# EAGLE design Arduino-Rework Station (EAGLE 8.2.2)

## Sheet 1 of 2
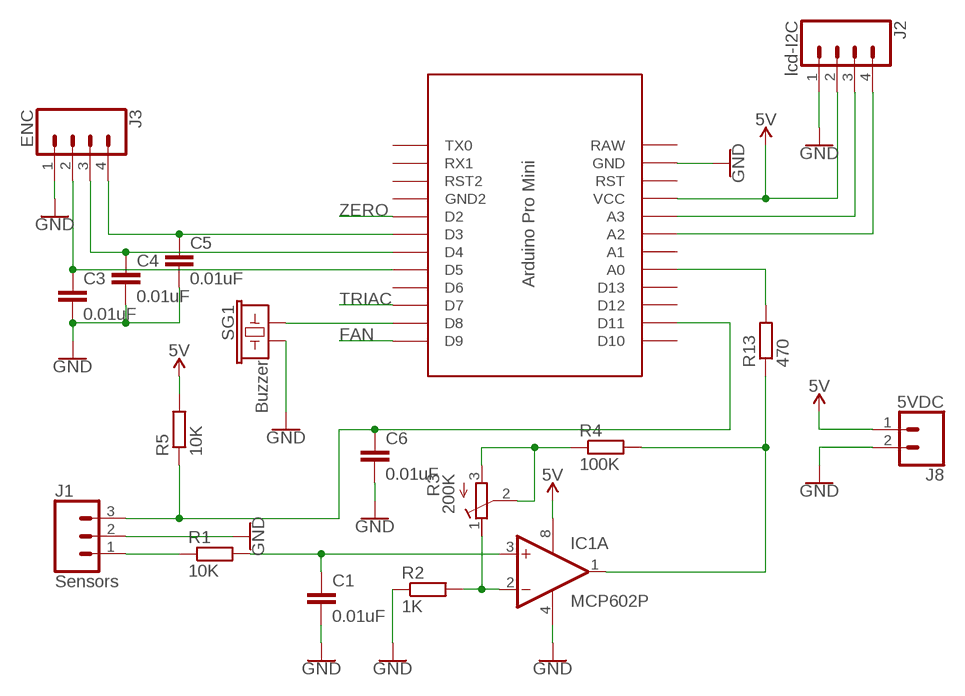
[diagram p0: schematic, sheet 1]

### Parts
C1  0.01uF  C-EU025-024X044  [C025-024X044]
C3  0.01uF  C-EU025-024X044  [C025-024X044]
C4  0.01uF  C-EU025-024X044  [C025-024X044]
C5  0.01uF  C-EU025-024X044  [C025-024X044]
C6  0.01uF  C-EU025-024X044  [C025-024X044]
IC1  MCP602P  [DIL08]
J1  Sensors  CONN_03POLAR  [MOLEX-1X3]
J2  lcd-I2C  CONN_04POLAR  [MOLEX-1X4]
J3  ENC  CONN_04POLAR  [MOLEX-1X4]
J8  5VDC  CONN_02POLAR  [MOLEX-1X2]
R1  10K  R-EU_0207/10  [0207/10]
R2  1K  R-EU_0207/10  [0207/10]
R3  200K  R-TRIMM3006P  [RTRIM3006P]
R4  100K  R-EU_0207/10  [0207/10]
R5  10K  R-EU_0207/10  [0207/10]
R13  470  R-EU_0207/10  [0207/10]
SG1  Buzzer  BUZZER-PTH  [BUZZER-12MM]
U$1  PRO-MINI  [PRO-MINI]

### Nets
5V: IC1.8(P:V+) J2.2 J8.1 R5.2 U$1.VCC ; also sheet 2
FAN: U$1.D9 ; also sheet 2
GND: C1.2 C3.2 C4.2 C5.2 C6.2 IC1.4(P:V-) J1.2 J2.1 J3.1 J8.2 R2.1 SG1.- U$1.GND ; also sheet 2
N$1: C5.1 J3.4 U$1.D3
N$2: C4.1 J3.3 U$1.D4
N$3: C3.1 J3.2 U$1.D5
N$4: J2.3 U$1.A3
N$5: J2.4 U$1.A2
N$6: J1.1 R1.1
N$7: C1.1 IC1.3(A:+IN) R1.2
N$8: IC1.2(A:-IN) R2.2 R3.1(E)
N$9: R3.2(S) R3.3(A) R4.1
N$10: IC1.1(A:OUT) R4.2 R13.1
N$11: C6.1 J1.3 R5.1 U$1.D11
N$12: SG1.+ U$1.D8
N$27: R13.2 U$1.A0
TRIAC: U$1.D7 ; also sheet 2
ZERO: U$1.D2 ; also sheet 2
Unconnected: IC1.5(B:+IN) IC1.6(B:-IN) IC1.7(B:OUT) U$1.A1 U$1.D6 U$1.D10 U$1.D12 U$1.D13 U$1.GND1(GND2) U$1.RST U$1.RST1(RST2) U$1.RX1 U$1.TX0

## Sheet 2 of 2
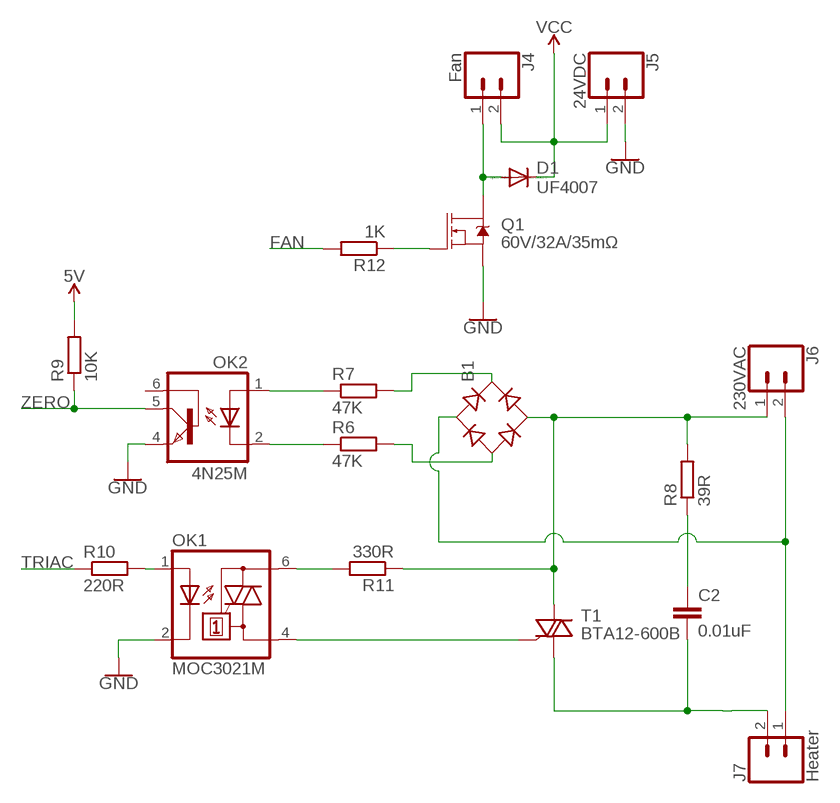
[diagram p1: schematic, sheet 2]

### Parts
B1  RB1A  [RB1A]
C2  0.01uF  C-EU050-045X075  [C050-045X075]
D1  UF4007  1N4004  [DO41-10]
J4  Fan  CONN_02POLAR  [MOLEX-1X2]
J5  24VDC  CONN_025MM  [SCREWTERMINAL-5MM-2]
J6  230VAC  CONN_02PTH4  [1X02_XTRA_BIG]
J7  Heater  CONN_02PTH4  [1X02_XTRA_BIG]
OK1  MOC3021M  [DIL06]
OK2  4N25M  [DIL06]
Q1  60V/32A/35mΩ  MOSFET-NCH-FQP30N06L  [TO220V]
R6  47K  R-EU_0204/7  [0204/7]
R7  47K  R-EU_0204/7  [0204/7]
R8  39R  R-EU_0617/22  [0617/22]
R9  10K  R-EU_0204/7  [0204/7]
R10  220R  R-EU_0204/7  [0204/7]
R11  330R  R-EU_0204/7  [0204/7]
R12  1K  R-EU_0204/7  [0204/7]
T1  BTA12-600B  BT138-V  [TO220BV]

### Nets
5V: R9.2 ; also sheet 1
FAN: R12.2 ; also sheet 1
GND: J5.2 OK1.2(C) OK2.4(EMI) Q1.3(S) ; also sheet 1
N$14: OK1.1(A) R10.2
N$15: OK2.1(A) R7.1
N$16: OK2.2(C) R6.1
N$17: B1.+ R7.2
N$18: B1.- R6.2
N$19: B1.AC2 J6.1 R8.2 R11.1 T1.T2(A2)
N$20: C2.1 R8.1
N$21: B1.AC1 J6.2 J7.1
N$22: OK1.6(A2) R11.2
N$23: OK1.4(A1) T1.G
N$24: D1.A J4.1 Q1.2(D)
N$25: C2.2 J7.2 T1.T1(A1)
N$26: Q1.1(G) R12.1
TRIAC: R10.1 ; also sheet 1
VCC: D1.C J4.2 J5.1
ZERO: OK2.5(COL) R9.1 ; also sheet 1
Unconnected: OK2.6(BAS)

## Power pins joined to a net without a drawn wire
RAW: U$1.RAW

## Library data of the parts
B1 = rectifier:RB1A: RECTIFIER 1 A
C1-C6 = resistor:C-EU: CAPACITOR, European symbol
D1 = diode:1N4004: DIODE general purpose rectifier, 1 A
IC1 = linear:MCP602: Single Op Amp 2.7V to 6.0V Single Supply CMOS Source: http://ww1.microchip.com/downloads/en/DeviceDoc/21314g.pdf
J1 = SparkFun-Connectors:CONN_03: Multi connection point. Often used as Generic Header-pin footprint for 0.1 inch spaced/style header connections On any of the 0.1 inch spaced packages, you can populate with these: Break Away Headers - Straight <https://www.sparkfun.com/products/116> (PRT-00116) Break Away Male Headers - Right Angle <https://www.sparkfun.com/products/553> (PRT-00553) Female Headers <https://www.sparkfun.com/products/115> (PRT-00115) Break Away Headers - Machine Pin <https://www.sparkfun.com/products/117> (PRT-00117) Break Away Female Headers - Swiss Machine Pin <https://www.sparkfun.com/products/743> (PRT-00743) Stackable Header - 3 Pin (Female, 0.1") <https://www.sparkfun.com/products/13875> (PRT-13875) For SCREWTERMINALS and SPRING TERMINALS visit here: Screw Terimnals on SparkFun.com <https://www.sparkfun.com/search/results?term=Screw+Terminals> (5mm/3.5mm/2.54mm spacing) This device is also useful as a general connection point to wire up your design to another part of your project. Our various solder wires solder well into these plated through hole pads. Hook-Up Wire - Assortment (Stranded, 22 AWG) <https://www.sparkfun.com/products/11375> (PRT-11375) Hook-Up Wire - Assortment (Solid Core, 22 AWG) <https://www.sparkfun.com/products/11367> (PRT-11367) View the entire wire category on our website here <https://www.sparkfun.com/categories/141> Special notes: Molex polarized connector foot print use with SKU : PRT-08232 with associated crimp pins and housings.; PROD_ID: CONN-08625; SF_ID: PRT-08096
J2 J3 = SparkFun-Connectors:CONN_04: Multi connection point. Often used as Generic Header-pin footprint for 0.1 inch spaced/style header connections On any of the 0.1 inch spaced packages, you can populate with these: Break Away Headers - Straight <https://www.sparkfun.com/products/116> (PRT-00116) Break Away Male Headers - Right Angle <https://www.sparkfun.com/products/553> (PRT-00553) Female Headers <https://www.sparkfun.com/products/115> (PRT-00115) Break Away Headers - Machine Pin <https://www.sparkfun.com/products/117> (PRT-00117) Break Away Female Headers - Swiss Machine Pin <https://www.sparkfun.com/products/743> (PRT-00743) For SCREWTERMINALS and SPRING TERMINALS visit here: Screw Terimnals on SparkFun.com <https://www.sparkfun.com/search/results?term=Screw+Terminals> (5mm/3.5mm/2.54mm spacing) This device is also useful as a general connection point to wire up your design to another part of your project. Our various solder wires solder well into these plated through hole pads. Hook-Up Wire - Assortment (Stranded, 22 AWG) <https://www.sparkfun.com/products/11375> (PRT-11375) Hook-Up Wire - Assortment (Solid Core, 22 AWG) <https://www.sparkfun.com/products/11367> (PRT-11367) View the entire wire category on our website here <https://www.sparkfun.com/categories/141> Special notes: Molex polarized connector foot print use with SKU : PRT-08231 with associated crimp pins and housings. 1MM SMD Version SKU: PRT-10208; PROD_ID: CONN-08186; SF_ID: PRT-08231
J4 J8 = SparkFun-Connectors:CONN_02: Multi connection point. Often used as Generic Header-pin footprint for 0.1 inch spaced/style header connections On any of the 0.1 inch spaced packages, you can populate with these: Break Away Headers - Straight <https://www.sparkfun.com/products/116> (PRT-00116) Break Away Male Headers - Right Angle <https://www.sparkfun.com/products/553> (PRT-00553) Female Headers <https://www.sparkfun.com/products/115> (PRT-00115) Break Away Headers - Machine Pin <https://www.sparkfun.com/products/117> (PRT-00117) Break Away Female Headers - Swiss Machine Pin <https://www.sparkfun.com/products/743> (PRT-00743) For SCREWTERMINALS and SPRING TERMINALS visit here: Screw Terimnals on SparkFun.com <https://www.sparkfun.com/search/results?term=Screw+Terminals> (5mm/3.5mm/2.54mm spacing) This device is also useful as a general connection point to wire up your design to another part of your project. Our various solder wires solder well into these plated through hole pads. Hook-Up Wire - Assortment (Stranded, 22 AWG) <https://www.sparkfun.com/products/11375> (PRT-11375) Hook-Up Wire - Assortment (Solid Core, 22 AWG) <https://www.sparkfun.com/products/11367> (PRT-11367) View the entire wire category on our website here <https://www.sparkfun.com/categories/141> Special notes: Molex polarized connector foot print use with: PRT-08233 with associated crimp pins and housings. 2.54_SCREWTERM for use with PRT-10571. 3.5mm Screw Terminal footprints for PRT-08084 5mm Screw Terminal footprints for use with PRT-08432; SF_ID: PRT-09918
J5 = SparkFun-Connectors:CONN_02: Multi connection point. Often used as Generic Header-pin footprint for 0.1 inch spaced/style header connections On any of the 0.1 inch spaced packages, you can populate with these: Break Away Headers - Straight <https://www.sparkfun.com/products/116> (PRT-00116) Break Away Male Headers - Right Angle <https://www.sparkfun.com/products/553> (PRT-00553) Female Headers <https://www.sparkfun.com/products/115> (PRT-00115) Break Away Headers - Machine Pin <https://www.sparkfun.com/products/117> (PRT-00117) Break Away Female Headers - Swiss Machine Pin <https://www.sparkfun.com/products/743> (PRT-00743) For SCREWTERMINALS and SPRING TERMINALS visit here: Screw Terimnals on SparkFun.com <https://www.sparkfun.com/search/results?term=Screw+Terminals> (5mm/3.5mm/2.54mm spacing) This device is also useful as a general connection point to wire up your design to another part of your project. Our various solder wires solder well into these plated through hole pads. Hook-Up Wire - Assortment (Stranded, 22 AWG) <https://www.sparkfun.com/products/11375> (PRT-11375) Hook-Up Wire - Assortment (Solid Core, 22 AWG) <https://www.sparkfun.com/products/11367> (PRT-11367) View the entire wire category on our website here <https://www.sparkfun.com/categories/141> Special notes: Molex polarized connector foot print use with: PRT-08233 with associated crimp pins and housings. 2.54_SCREWTERM for use with PRT-10571. 3.5mm Screw Terminal footprints for PRT-08084 5mm Screw Terminal footprints for use with PRT-08432; SF_SKU: PRT-08432
J6 J7 = SparkFun-Connectors:CONN_02: Multi connection point. Often used as Generic Header-pin footprint for 0.1 inch spaced/style header connections On any of the 0.1 inch spaced packages, you can populate with these: Break Away Headers - Straight <https://www.sparkfun.com/products/116> (PRT-00116) Break Away Male Headers - Right Angle <https://www.sparkfun.com/products/553> (PRT-00553) Female Headers <https://www.sparkfun.com/products/115> (PRT-00115) Break Away Headers - Machine Pin <https://www.sparkfun.com/products/117> (PRT-00117) Break Away Female Headers - Swiss Machine Pin <https://www.sparkfun.com/products/743> (PRT-00743) For SCREWTERMINALS and SPRING TERMINALS visit here: Screw Terimnals on SparkFun.com <https://www.sparkfun.com/search/results?term=Screw+Terminals> (5mm/3.5mm/2.54mm spacing) This device is also useful as a general connection point to wire up your design to another part of your project. Our various solder wires solder well into these plated through hole pads. Hook-Up Wire - Assortment (Stranded, 22 AWG) <https://www.sparkfun.com/products/11375> (PRT-11375) Hook-Up Wire - Assortment (Solid Core, 22 AWG) <https://www.sparkfun.com/products/11367> (PRT-11367) View the entire wire category on our website here <https://www.sparkfun.com/categories/141> Special notes: Molex polarized connector foot print use with: PRT-08233 with associated crimp pins and housings. 2.54_SCREWTERM for use with PRT-10571. 3.5mm Screw Terminal footprints for PRT-08084 5mm Screw Terminal footprints for use with PRT-08432
OK1 = optocoupler:MOC30*M: RANDOM-PHASE OPTOISOLATORS TRIAC DRIVER OUTPUT Source: http://www.fairchildsemi.com MOC3020-M.pdf; MF: FAIRCHILD SEMICONDUCTOR; MPN: MOC3021-M; OC_FARNELL: 1021365; OC_NEWARK: 95B7895
OK2 = optocoupler:4N*?M: General Purpose 6-Pin Phototransistor Optocouplers Source: http://www.fairchildsemi.com/ds/4N/4N35-M.pdf; MPN: 4N25-M; OC_FARNELL: 1021349; OC_NEWARK: 98K9084
Q1 = SparkFun-DiscreteSemi:MOSFET-NCH: N-channel MOSFETs Voltage controlled devices that allow control of high current outputs. SparkFun Products: SparkFun OpenScale <https://www.sparkfun.com/products/13261> SparkFun Digital Sandbox <https://www.sparkfun.com/products/12651> SparkFun Monster Moto Shield <https://www.sparkfun.com/products/10182> SparkFun MOSFET Power Controller <https://www.sparkfun.com/products/11214>; PROD_ID: TRANS-10060
R1 R2 R4-R13 = resistor:R-EU_: RESISTOR, European symbol
R3 = resistor:R-TRIMM: Trimm resistor
SG1 = SparkFun-Electromechanical:BUZZER: Buzzer Small round buzzers that operate around the audible 2kHz range. You can use these as speakers to create simple music or user interfaces. Variant Overview: PTH - Mini Speaker - PC Mount 12mm 2.048kHz <https://www.sparkfun.com/products/7950> PTH_KIT - Mini Speaker - PC Mount 12mm 2.048kHz <https://www.sparkfun.com/products/7950> KIT simplifies soldering by adding stop mask to one side of the pads. PTH_NO_SILK - Mini Speaker - PC Mount 12mm 2.048kHz <https://www.sparkfun.com/products/7950> No silkscreen indicator of buzzer outline. PTH_KIT_NO_SILK - Mini Speaker - PC Mount 12mm 2.048kHz <https://www.sparkfun.com/products/7950> KIT package w/o silkscreen SMD - Buzzer Audio Magnetic (CCV-084B16) SMD buzzer used on, e.g. the LilyPad Buzzer <https://www.sparkfun.com/products/8463> and RFID USB Reader <https://www.sparkfun.com/products/9963>. SMD_KIT - Buzzer Audio Magnetic (CCV-084B16) SMD Buzzer with elongated pins to make soldering easier. Used on the SparkFun Simon Says - Surface Mount Soldering Kit <https://www.sparkfun.com/products/10935>.; PROD_ID: COMP-08253; SF_SKU: COM-07950
T1 = triac:BT138: TRIAC Source: http://www.semiconductors.philips.com BT138_SERIES_2.pdf
U$1 = Arduino-clone:PRO-MINI: Arduion Pro Mini Clone V1.0 www.betemcu.cu

## Board
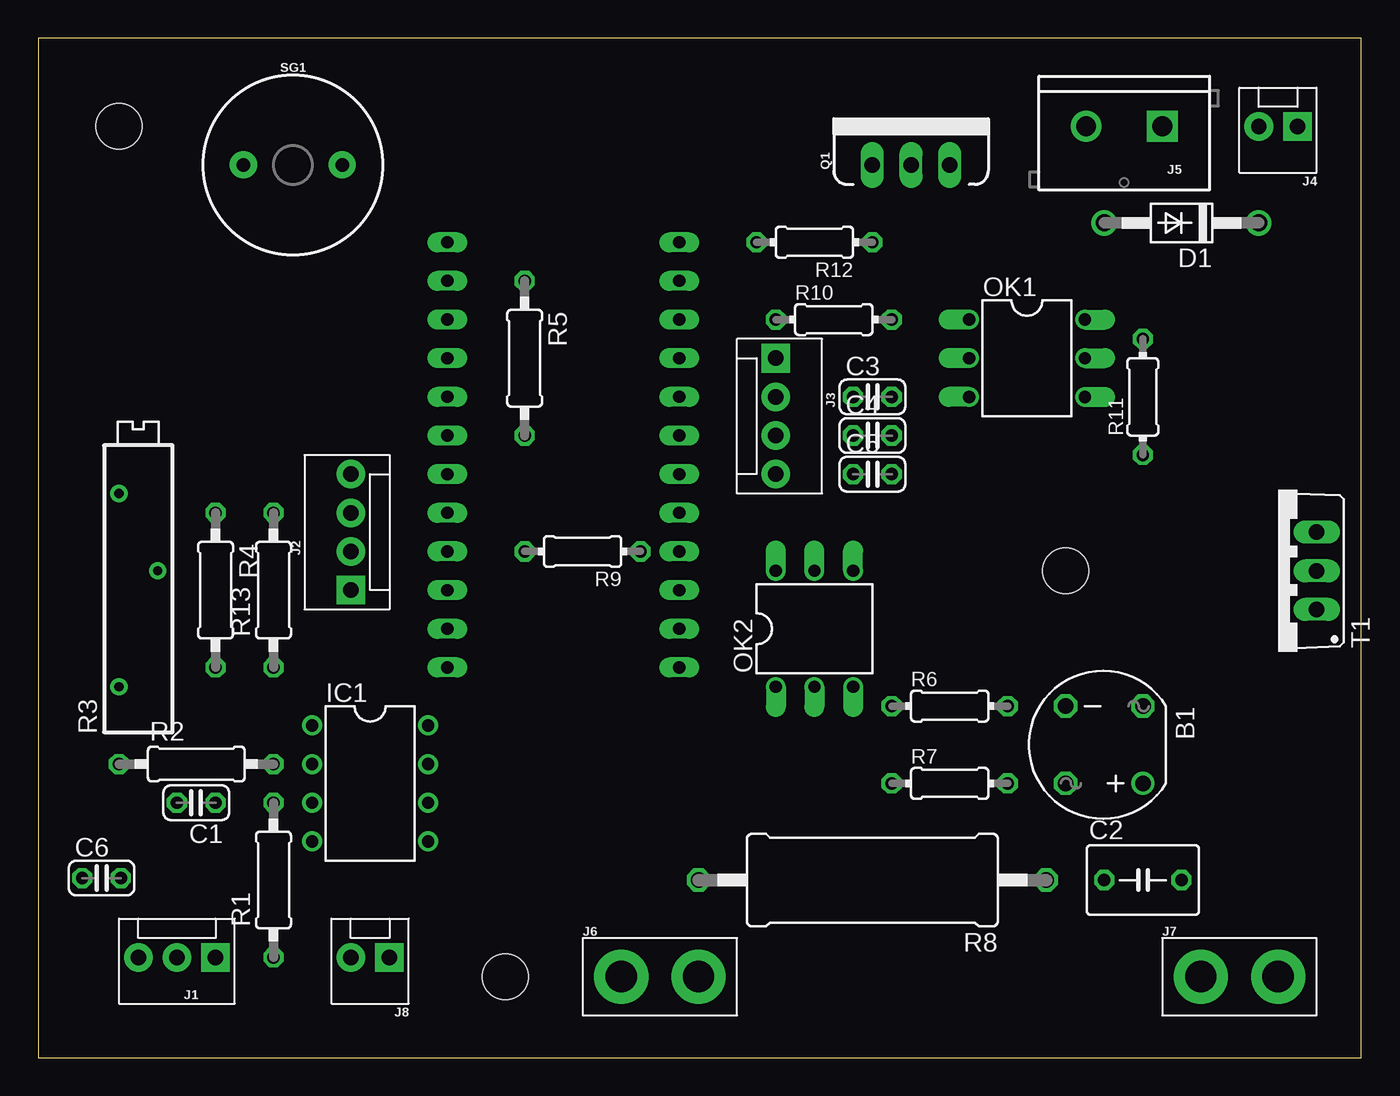
[diagram p2: board, top side]
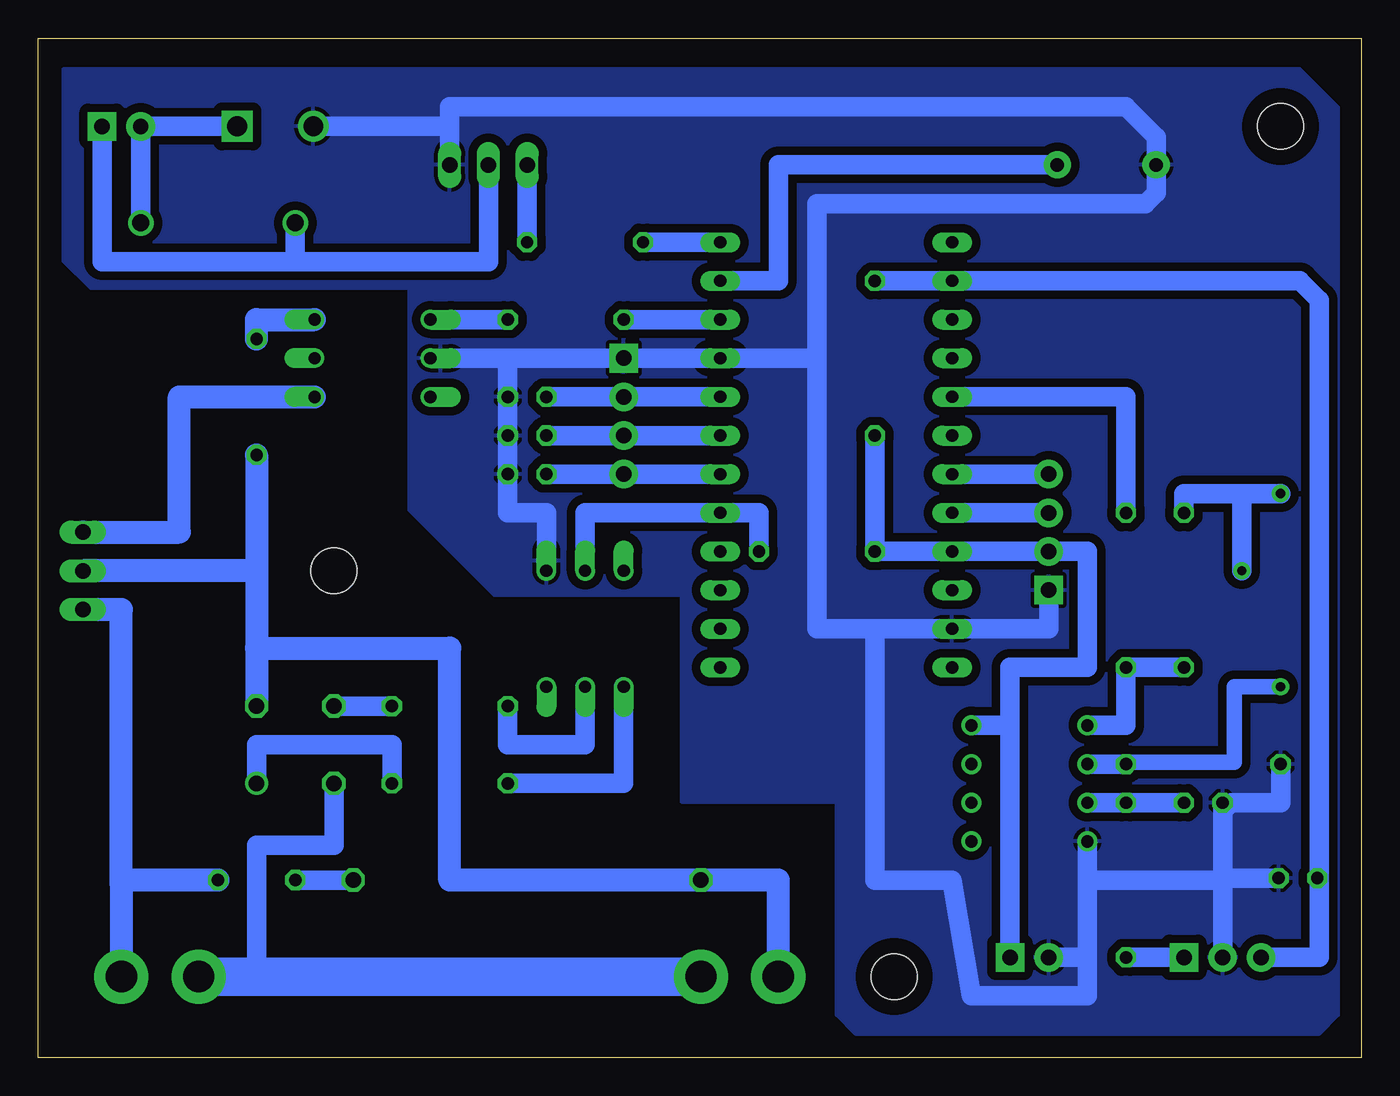
[diagram p3: board, bottom side, seen from below]

Size 87 x 67 mm. Coordinates in mm from the lower left corner, seen from the top.
Outline: 0,0 87,0 87,67 0,67 0,0
Copper layers (1*16): Top 0.035mm / dielectric 1.5mm / Bottom 0.035mm
Design rules "default *": minimum track width 6mil, minimum drill 0.35mm, track to track 22mil, track to pad 22mil, pad to pad 6mil, via to via 6mil, smd to smd 6mil, copper to edge 40mil, drill to drill 6mil, minimum pad ring 10mil, minimum via ring 8mil, stop-mask expansion 4mil, vias tented up to drill 0mil, thermal gap 10mil
Holes 3 mm at 5.32,61.2 30.72,5.32 67.55,31.99

### Footprints (pad centres in the part's own frame; a part is rotated, then mirrored left to right if it is on the bottom)
RB1A = drill 1.016: + -2.54,2.54 | drill 1.016 octagon: - 2.54,-2.54; AC1 2.54,2.54; AC2 -2.54,-2.54
C025-024X044 = drill 0.813 octagon: 1 -1.27,0; 2 1.27,0
C050-045X075 = drill 0.813 octagon: 1 -2.54,0; 2 2.54,0
DO41-10 = drill 1.118: A 5.08,0; C -5.08,0
DIL08 = drill 0.813 pad 1.27: 1 -3.81,-3.81; 2 -1.27,-3.81; 3 1.27,-3.81; 4 3.81,-3.81; 5 3.81,3.81; 6 1.27,3.81; 7 -1.27,3.81; 8 -3.81,3.81
MOLEX-1X3 = drill 1.016 pad 1.88 square: 1 0,0 | drill 1.016 pad 1.88: 2 2.54,0; 3 5.08,0
MOLEX-1X4 = drill 1.016 pad 1.88 square: 1 0,0 | drill 1.016 pad 1.88: 2 2.54,0; 3 5.08,0; 4 7.62,0
MOLEX-1X2 = drill 1.016 pad 1.88 square: 1 0,0 | drill 1.016 pad 1.88: 2 2.54,0
SCREWTERMINAL-5MM-2 = drill 1.3 pad 2.032 square: 1 0,0 | drill 1.3 pad 2.032: 2 5,0
1X02_XTRA_BIG = drill 2.057 pad 3.556: 1 -2.54,0; 2 2.54,0
DIL06 = drill 0.813 offset: 1 -2.54,-3.81; 2 0,-3.81; 3 2.54,-3.81; 4 2.54,3.81; 5 0,3.81; 6 -2.54,3.81
TO220V = drill 1.016 long: 1 -2.54,0; 2 0,0; 3 2.54,0
0207/10 = drill 0.813 octagon: 1 -5.08,0; 2 5.08,0
RTRIM3006P = drill 0.61: 1 -7.62,1.27; 2 0,-1.27; 3 5.08,1.27
0204/7 = drill 0.813 octagon: 1 -3.81,0; 2 3.81,0
0617/22 = drill 1.016 octagon: 1 -11.43,0; 2 11.43,0
BUZZER-12MM = drill 0.9 pad 1.778: + 3.25,0; - -3.25,0
TO220BV = drill 1.016 long: G 2.54,-2.54; T1 -2.54,-2.54; T2 0,-2.54
PRO-MINI = drill 0.8 long: A0 8.89,8.89; A1 8.89,11.43; A2 8.89,13.97; A3 8.89,16.51; D2 -6.35,16.51; D3 -6.35,13.97; D4 -6.35,11.43; D5 -6.35,8.89; D6 -6.35,6.35; D7 -6.35,3.81; D8 -6.35,1.27; D9 -6.35,-1.27; D10 8.89,-1.27; D11 8.89,1.27; D12 8.89,3.81; D13 8.89,6.35; GND 8.89,24.13; GND1 -6.35,19.05; RAW 8.89,26.67; RST 8.89,21.59; RST1 -6.35,21.59; RX1 -6.35,24.13; TX0 -6.35,26.67; VCC 8.89,19.05

### Placement (x,y rotation side)
B1  70.09,20.56 180 top
C1  10.4,16.75 180 top
C2  72.63,11.67 0 top
C3  54.85,43.42 0 top
C4  54.85,40.88 0 top
C5  54.85,38.34 0 top
C6  4.18,11.8 0 top
D1  75.17,54.85 180 top
IC1  21.83,18.02 270 top
J1  11.67,6.59 180 top
J2  20.56,30.72 90 top
J3  48.5,45.96 270 top
J4  82.79,61.2 180 top
J5  73.9,61.2 180 top
J6  40.88,5.32 0 top
J7  78.98,5.32 0 top
J8  23.1,6.59 180 top
OK1  65.01,45.96 270 top
OK2  51.04,28.18 0 top
Q1  57.39,58.66 0 top
R1  15.48,11.67 90 top
R2  10.4,19.29 0 top
R3  6.59,31.99 90 top
R4  11.67,30.72 270 top
R5  31.99,45.96 270 top
R6  59.93,23.1 0 top
R7  59.93,18.02 0 top
R8  54.85,11.67 180 top
R9  35.8,33.26 180 top
R10  52.31,48.5 0 top
R11  72.63,43.42 90 top
R12  51.04,53.58 180 top
R13  15.48,30.72 90 top
SG1  16.75,58.66 0 top
T1  81.52,31.99 90 top
U$1  35.8,52.31 180 top

### Tracks (layer width: path | path; a pad name or v marks a point on that pad's centre or on a via)
5V
  Bottom 1.27: 23.1,21.83 23.1,25.64 18.02,25.64 18.02,33.26 J2.2 U$1.VCC R9.2 R5.2 | 23.1,21.83 IC1.8 | J8.1 23.1,21.83
FAN
  Bottom 1.27: R12.2 U$1.D9
GND
  Bottom 1.27: 59.93,61.2 Q1.3 | 59.93,61.2 J5.2 | 56.12,45.96 J3.1 35.8,45.96 | 56.12,45.96 C3.2 C4.2 C5.2 56.12,35.8 53.58,35.8 OK2.4 | 59.93,61.2 59.93,62.47 15.48,62.47 13.5,60.49 SG1.- 13.5,56.83 14.21,56.12 35.8,56.12 35.8,45.96 | 56.12,45.96 OK1.2 | J2.1 20.56,28.18 U$1.GND 31.99,28.18 | 31.99,28.18 35.8,28.18 35.8,45.96 | 31.99,28.18 31.99,11.67 26.91,11.67 25.64,4.05 18.02,4.05 18.02,6.59 | 9.13,11.67 18.02,11.67 | 9.13,16.18 9.13,11.67 | 9.13,16.18 C1.2 | J1.2 9.13,11.67 | IC1.4 18.02,11.67 | R2.1 5.32,16.75 8.56,16.75 9.13,16.18 | 18.02,6.59 18.02,11.67 | J8.2 18.02,6.59 | C6.2 9.13,11.8 9.13,11.67
  pour Bottom: 33.26,1.51 34.53,2.78 34.53,16.75 44.69,16.75 44.69,30.34 57.01,30.34 62.6,35.93 62.6,50.53 83.55,50.53 85.33,52.31 85.33,65.01 4.05,65.01 1.51,62.47 1.51,2.78 2.78,1.51
N$1
  Bottom 1.27: U$1.D3 J3.4 C5.1
N$2
  Bottom 1.27: U$1.D4 J3.3 C4.1
N$3
  Bottom 1.27: U$1.D5 J3.2 C3.1
N$4
  Bottom 1.27: J2.3 U$1.A3
N$5
  Bottom 1.27: J2.4 U$1.A2
N$6
  Bottom 1.27: J1.1 R1.1
N$7
  Bottom 1.27: C1.1 R1.2 IC1.3
N$8
  Bottom 1.016: R3.1 8.37,24.37 8.37,19.42 15.48,19.42 R2.2
  Bottom 1.27: IC1.2 R2.2
N$9
  Bottom 1.27: 7.86,37.07 R3.3 | 7.86,37.07 11.67,37.07 R4.1 | R3.2 7.86,37.07
N$10
  Bottom 1.27: R4.2 R13.1 15.48,21.83 IC1.1
N$11
  Bottom 1.016: C6.1 arc-90 2.79,11.68 2.78,11.68
  Bottom 1.27: R5.1 U$1.D11 4.05,51.04 2.78,49.77 2.78,11.68 2.78,6.59 J1.3
N$12
  Bottom 1.27: SG1.+ 38.34,58.66 38.34,51.04 U$1.D8
N$13  (via drill 0.35)
  other vias: 42.15,45.96
N$14
  Bottom 1.27: R10.2 OK1.1
N$15
  Bottom 1.27: OK2.1 48.5,18.02 R7.1
N$16
  Bottom 1.27: OK2.2 51.04,20.56 56.12,20.56 R6.1
N$17
  Bottom 1.27: B1.+ 72.63,20.56 63.74,20.56 R7.2
N$18
  Bottom 1.27: B1.- R6.2
N$19
  Bottom 1.5: J6.1 38.34,11.67 R8.2 59.93,11.67 59.93,26.91 72.63,26.91 | 72.63,26.91 B1.AC2 | 72.63,31.99 T1.T2 | 72.63,31.99 72.63,26.91 | R11.1 72.63,31.99
N$20
  Bottom 1.27: R8.1 C2.1
N$21
  Bottom 1.27: B1.AC1 67.55,13.96 72.63,13.96 72.63,5.32
  Bottom 2.54: J7.1 72.63,5.32 J6.2
N$22
  Bottom 1.5: R11.2 72.63,48.5 OK1.6
N$23
  Bottom 1.5: OK1.4 77.71,43.42 77.71,34.53 T1.G
N$24
  Bottom 1.27: J4.1 82.79,52.31 70.09,52.31 | 70.09,52.31 57.39,52.31 Q1.2 | D1.A 70.09,52.31
N$25
  Bottom 1.5: T1.T1 81.52,29.45 81.52,11.3 | 81.52,11.3 J7.2 | C2.2 81.15,11.67 81.52,11.3
N$26
  Bottom 1.27: Q1.1 R12.1
N$27
  Bottom 1.27: R13.2 15.48,43.42 U$1.A0
TRIAC
  Bottom 1.27: U$1.D7 R10.1
VCC
  Bottom 1.27: J5.1 J4.2 D1.C
ZERO
  Bottom 1.27: OK2.5 51.04,35.8 U$1.D2 39.61,35.8 R9.1